# EasyEDA Pro project RCkid.epro, schematic Cartridge Connector
Board Name: Cartridge Connector; Create Date: 2025-02-24; Page Name: Connector; Project Name: rckid3_devboard; Schematic Name: Cartridge Connector; Update Date: 2025-02-26; Company: EasyEDA.com; Page Size: A4; Version: V1.0
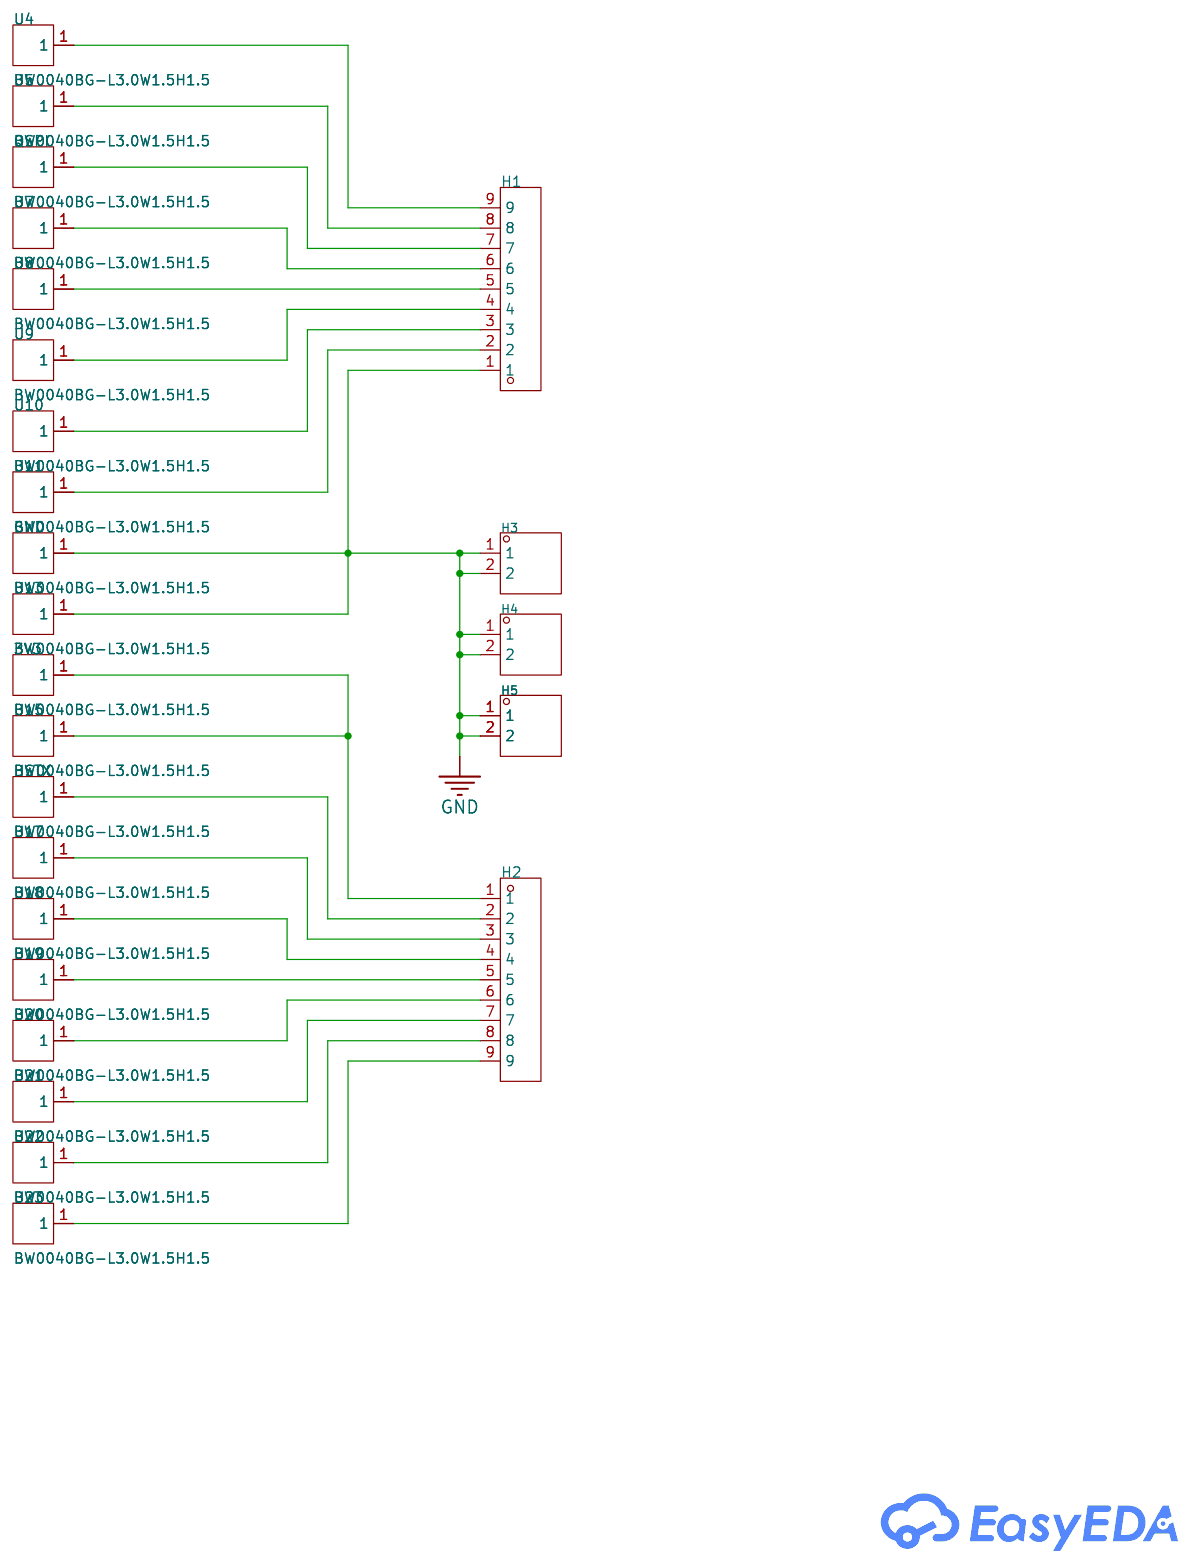
[diagram p14: schematic sheet]

## Parts
3V3  BW0040BG-L3.0W1.5H1.5  [SMD_L3.0-W1.5_681-MB106E-2-P2]
GND  BW0040BG-L3.0W1.5H1.5  [SMD_L3.0-W1.5_681-MB106E-2-P2]
H1  -  [HDR-TH_9P-P2.54-V-M]
H2  -  [HDR-TH_9P-P2.54-V-M]
H3  -  [HDR-TH_2P-P2.54-V-M-1]
H4  -  [HDR-TH_2P-P2.54-V-M-1]
H5  -  [HDR-TH_2P-P2.54-V-M-1]
HSTX  BW0040BG-L3.0W1.5H1.5  [SMD_L3.0-W1.5_681-MB106E-2-P2]
QSPI  BW0040BG-L3.0W1.5H1.5  [SMD_L3.0-W1.5_681-MB106E-2-P2]
U4  BW0040BG-L3.0W1.5H1.5  [SMD_L3.0-W1.5_681-MB106E-2-P2]
U5  BW0040BG-L3.0W1.5H1.5  [SMD_L3.0-W1.5_681-MB106E-2-P2]
U7  BW0040BG-L3.0W1.5H1.5  [SMD_L3.0-W1.5_681-MB106E-2-P2]
U8  BW0040BG-L3.0W1.5H1.5  [SMD_L3.0-W1.5_681-MB106E-2-P2]
U9  BW0040BG-L3.0W1.5H1.5  [SMD_L3.0-W1.5_681-MB106E-2-P2]
U10  BW0040BG-L3.0W1.5H1.5  [SMD_L3.0-W1.5_681-MB106E-2-P2]
U11  BW0040BG-L3.0W1.5H1.5  [SMD_L3.0-W1.5_681-MB106E-2-P2]
U13  BW0040BG-L3.0W1.5H1.5  [SMD_L3.0-W1.5_681-MB106E-2-P2]
U15  BW0040BG-L3.0W1.5H1.5  [SMD_L3.0-W1.5_681-MB106E-2-P2]
U17  BW0040BG-L3.0W1.5H1.5  [SMD_L3.0-W1.5_681-MB106E-2-P2]
U18  BW0040BG-L3.0W1.5H1.5  [SMD_L3.0-W1.5_681-MB106E-2-P2]
U19  BW0040BG-L3.0W1.5H1.5  [SMD_L3.0-W1.5_681-MB106E-2-P2]
U20  BW0040BG-L3.0W1.5H1.5  [SMD_L3.0-W1.5_681-MB106E-2-P2]
U21  BW0040BG-L3.0W1.5H1.5  [SMD_L3.0-W1.5_681-MB106E-2-P2]
U22  BW0040BG-L3.0W1.5H1.5  [SMD_L3.0-W1.5_681-MB106E-2-P2]
U23  BW0040BG-L3.0W1.5H1.5  [SMD_L3.0-W1.5_681-MB106E-2-P2]

## Library data of the parts
3V3 GND HSTX QSPI U4 U5 U7-U11 U13 U15 U17-U23 = BW0040BG-L3.0W1.5H1.5: size:- material quality:Stainless steel frequency range:- impedance:- Under pressure:-; LCSC Part Name: BAT WIRELESS(蝙蝠无线) 天线弹片 3mmx1.5mmx1.5mm 301不锈钢 圆盘; Supplier Part: C2826540; Manufacturer: BAT WIRELESS(蝙蝠无线); JLCPCB Part Class: Extended Part; Datasheet: https://atta.szlcsc.com/upload/public/pdf/source/20210416/C2826540_3C1CAAA83C3529E2F8541F2496EE9B59.pdf; Supplier: LCSC; material quality: Stainless steel
H1 H2 = HDR-M_2.54-1x9P: Supplier Footprint: Through
H3-H5 = HDR-M_2.54_1x2P: Supplier Footprint: Through

## Nets
GND: GND.1 H1.1 H3.1 H3.2 H4.1 H4.2 H5.1 H5.2 U13.1
$1N2052: H1.9 U4.1
$1N2058: H1.8 U5.1
$1N2065: H1.7 QSPI.1
$1N2075: H1.6 U7.1
$1N2082: H1.5 U8.1
$1N2087: H1.4 U9.1
$1N2094: H1.3 U10.1
$1N2101: H1.2 U11.1
$1N2108: H2.9 U23.1
$1N2118: H2.8 U22.1
$1N2128: H2.7 U21.1
$1N2135: H2.6 U20.1
$1N2142: H2.5 U19.1
$1N2147: H2.4 U18.1
$1N2154: H2.3 U17.1
$1N2161: H2.2 HSTX.1
$1N2168: 3V3.1 H2.1 U15.1
